# EAGLE design 2015 Receive LCD (EAGLE 6.5.0)
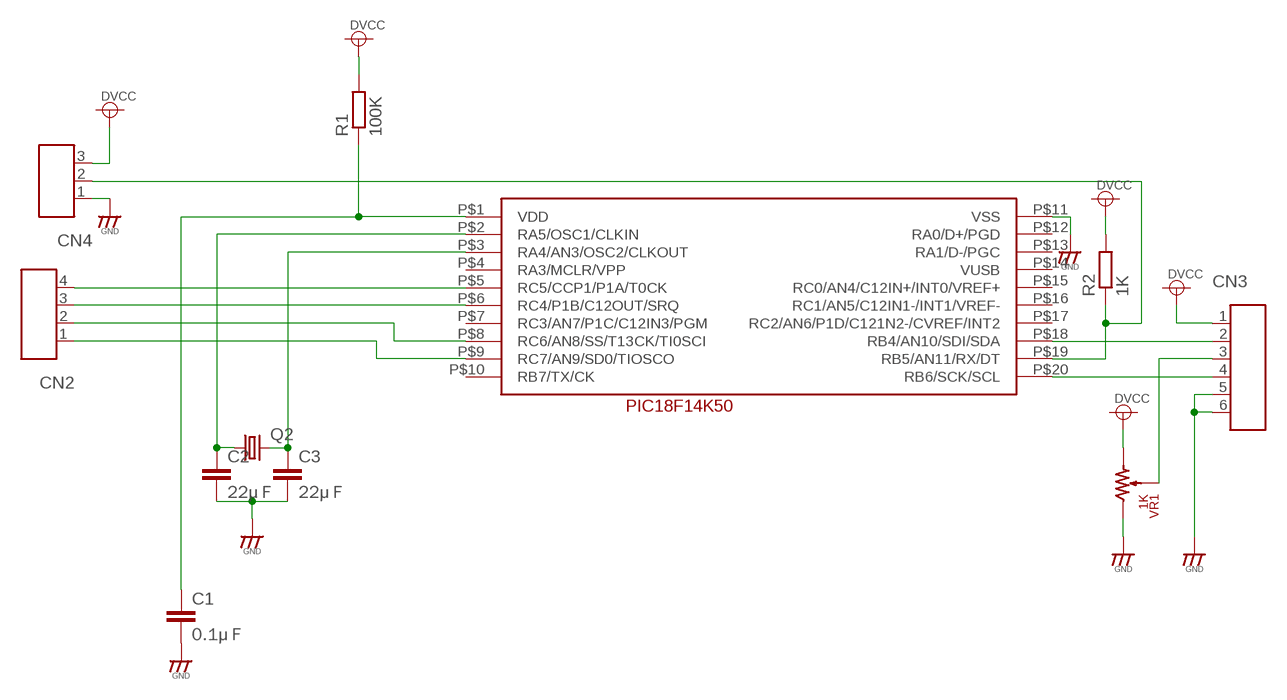
[diagram p0: schematic, sheet 1]

## Parts
C1  0.1μＦ  C-EU025-025X050  [C025-025X050]
C2  22μＦ  C-EU025-025X050  [C025-025X050]
C3  22μＦ  C-EU025-025X050  [C025-025X050]
CN2  CON_4P  [CON_HRS_DIP_4]
CN3  CON_6P  [CON_HRS_DIP_6]
CN4  CON_3P  [CON_HRS_DIP_3]
IC1  PIC18F14K50  [PIC18F14K50]
Q2  CRYTALHC49U70  [HC49U70]
R1  100K  R-EU_0204/7  [0204/7]
R2  1K  R-EU_0204/7  [0204/7]
VR1  1K  TRM  [TRM]

## Nets
DVCC: CN3.1 CN4.3 R1.2 R2.2 VR1.P$1
GND: C1.2 C2.2 C3.2 CN3.5 CN3.6 CN4.1 IC1.P$11(VSS) VR1.P$3
N$1: C1.1 IC1.P$1(VDD) R1.1
N$2: C3.1 IC1.P$3(RA4/AN3/OSC2/CLKOUT) Q2.2
N$3: C2.1 IC1.P$2(RA5/OSC1/CLKIN) Q2.1
N$4: CN2.1 IC1.P$9(RC7/AN9/SD0/TIOSCO)
N$5: CN3.2 IC1.P$18(RB4/AN10/SDI/SDA)
N$6: CN2.3 IC1.P$6(RC4/P1B/C12OUT/SRQ)
N$7: CN2.4 IC1.P$5(RC5/CCP1/P1A/T0CK)
N$8: CN2.2 IC1.P$8(RC6/AN8/SS/T13CK/TI0SCI)
N$9: CN3.4 IC1.P$20(RB6/SCK/SCL)
N$10: CN3.3 VR1.P$2
N$11: CN4.2 IC1.P$19(RB5/AN11/RX/DT) R2.1
Unconnected: IC1.P$7(RC3/AN7/P1C/C12IN3/PGM) IC1.P$10(RB7/TX/CK) IC1.P$12(RA0/D+/PGD) IC1.P$13(RA1/D-/PGC) IC1.P$14(VUSB) IC1.P$15(RC0/AN4/C12IN+/INT0/VREF+) IC1.P$16(RC1/AN5/C12IN1-/INT1/VREF-) IC1.P$17(RC2/AN6/P1D/C121N2-/CVREF/INT2)

## Power pins joined to a net without a drawn wire
RA3/MCLR/VPP: IC1.P$4(RA3/MCLR/VPP)

## Library data of the parts
C1-C3 = rcl:C-EU: CAPACITOR, European symbol
CN2 = da_parts:CON_4P
CN3 = da_parts:CON_6P
CN4 = da_parts:CON_3P
IC1 = pic18f14k50:PIC18F14K50
Q2 = crystal:CRYTAL: CRYSTAL
R1 R2 = rcl:R-EU_: RESISTOR, European symbol
VR1 = hardwarelib:TRM

## Net classes
0 default: clearance 0.205 mm

## Board
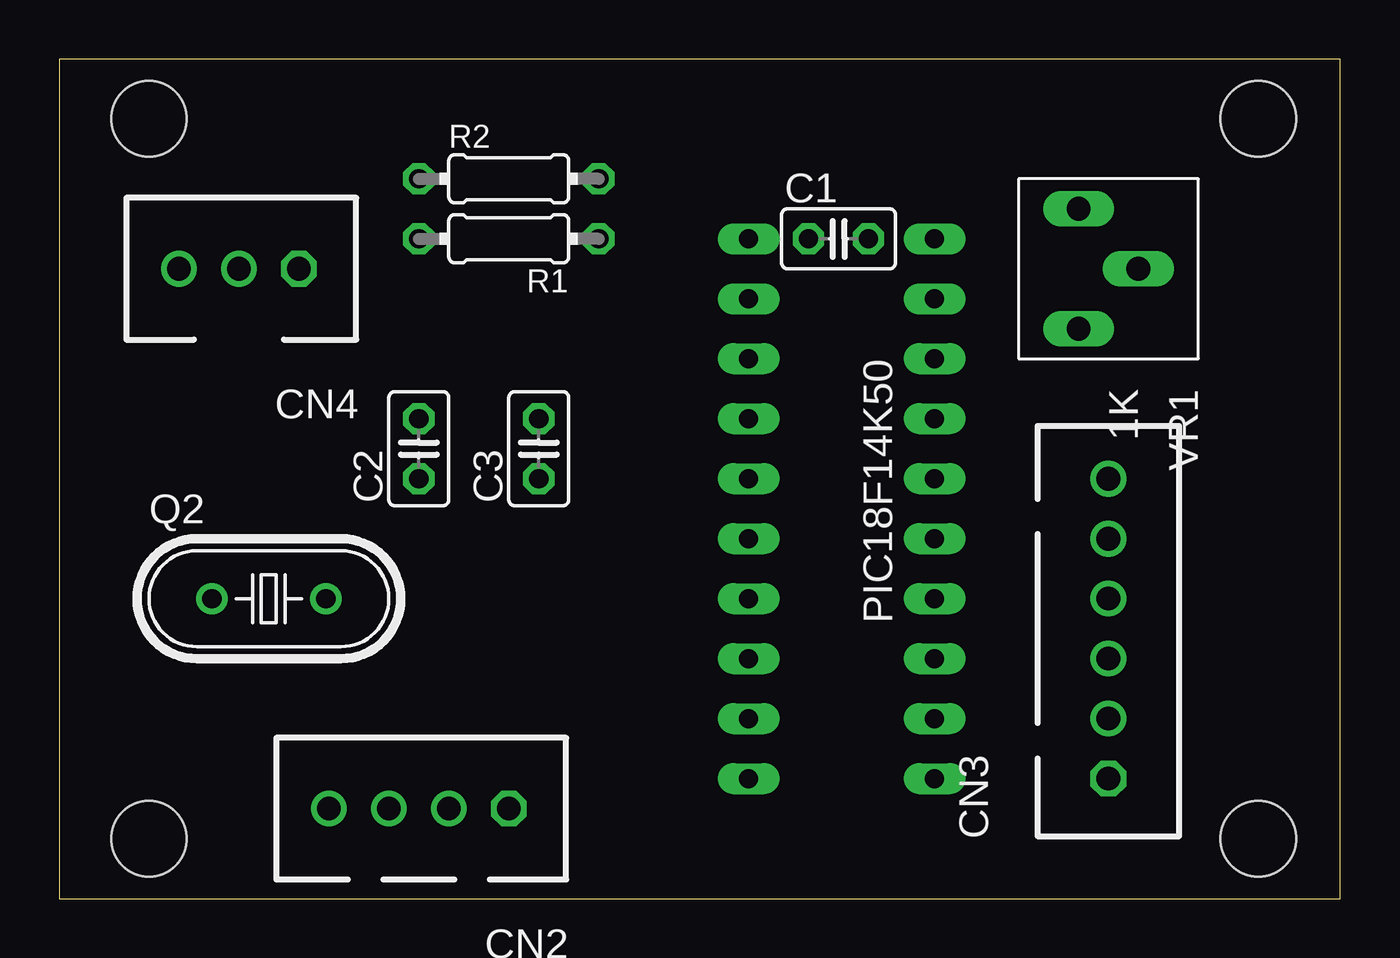
[diagram p1: board, top side]
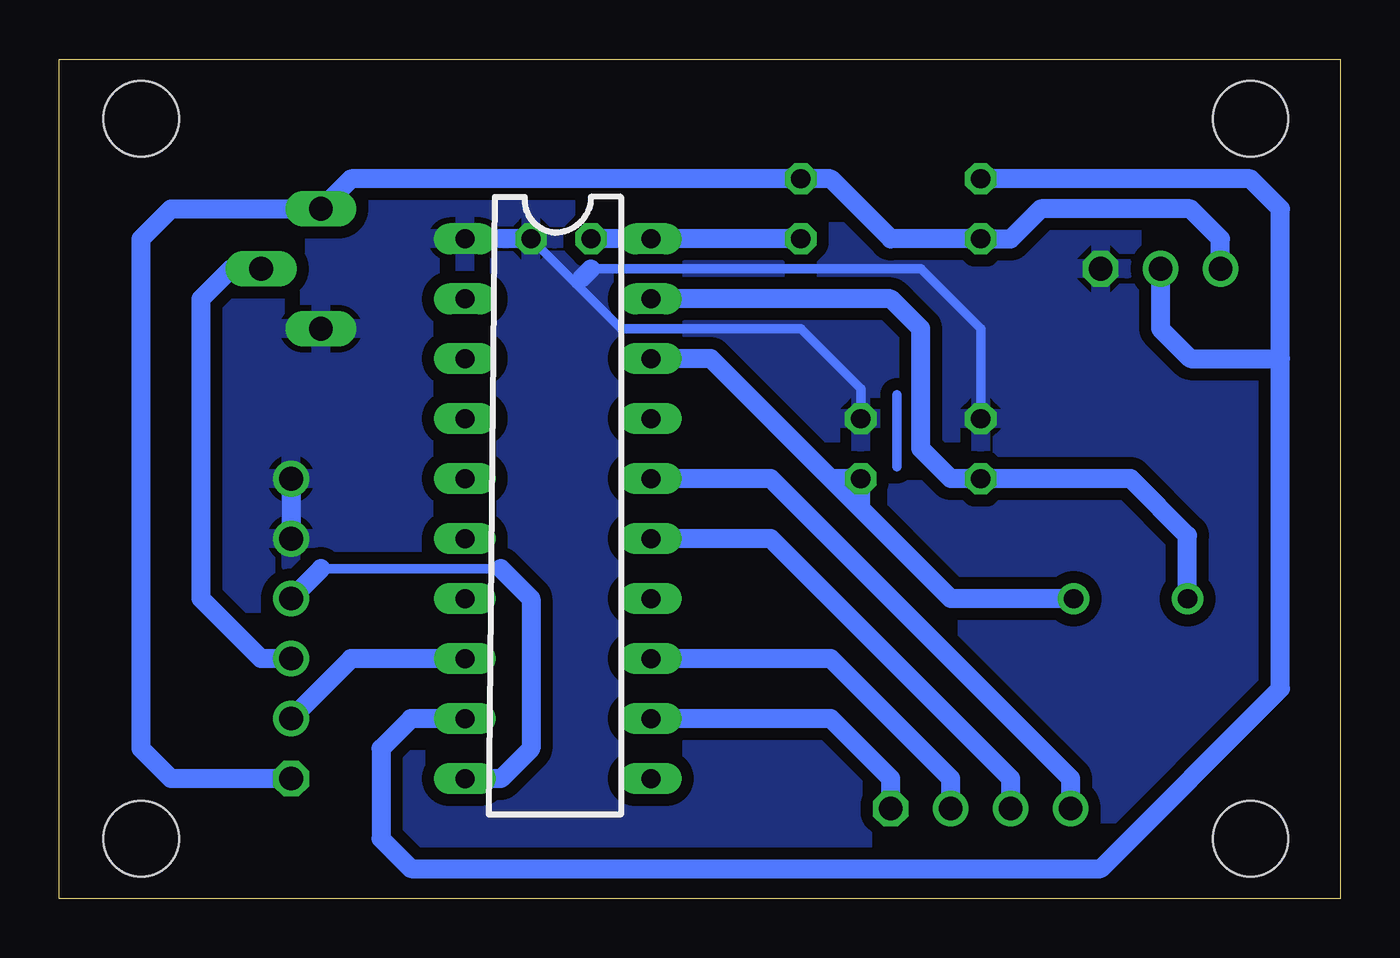
[diagram p2: board, bottom side, seen from below]

Size 54.28 x 35.55 mm. Coordinates in mm from the lower left corner, seen from the top.
Outline: 0,0 54.28,0 54.28,35.55 0,35.55 0,0
Copper layers (1*16): Top 0.035mm / dielectric 1.5mm / Bottom 0.035mm
Design rules "default *": minimum track width 10mil, minimum drill 24mil, track to track 20mil, track to pad 20mil, pad to pad 20mil, via to via 20mil, smd to smd 20mil, copper to edge 40mil, drill to drill 8mil, minimum pad ring 10mil, minimum via ring 8mil, stop-mask expansion 4mil, vias tented up to drill 0mil, thermal gap 10mil
Holes 3.2 mm at 3.81,2.54 3.81,33.02 50.8,33.02 50.8,2.54

### Footprints (pad centres in the part's own frame; a part is rotated, then mirrored left to right if it is on the bottom)
C025-025X050 = drill 0.813 octagon: 1 -1.27,0; 2 1.27,0
CON_HRS_DIP_4 = drill 1 octagon: 1 -3.81,0 | drill 1: 2 -1.27,0; 3 1.27,0; 4 3.81,0
CON_HRS_DIP_6 = drill 1 octagon: 1 -6.35,0 | drill 1: 2 -3.81,0; 3 -1.27,0; 4 1.27,0; 5 3.81,0; 6 6.35,0
CON_HRS_DIP_3 = drill 1 octagon: 1 -2.54,0 | drill 1: 2 0,0; 3 2.54,0
PIC18F14K50 = drill 0.8 long: P$1 -5.08,10.16; P$2 -5.08,7.62; P$3 -5.08,5.08; P$4 -5.08,2.54; P$5 -5.08,0; P$6 -5.08,-2.54; P$7 -5.08,-5.08; P$8 -5.08,-7.62; P$9 -5.08,-10.16; P$10 -5.08,-12.7; P$11 2.794,10.16; P$12 2.794,7.62; P$13 2.794,5.08; P$14 2.794,2.54; P$15 2.794,0; P$16 2.794,-2.54; P$17 2.794,-5.08; P$18 2.794,-7.62; P$19 2.794,-10.16; P$20 2.794,-12.7
HC49U70 = drill 0.813: 1 -2.413,0; 2 2.413,0
0204/7 = drill 0.813 octagon: 1 -3.81,0; 2 3.81,0
TRM = drill 1 long: P$1 0,0; P$2 2.54,2.54; P$3 5.08,0

### Placement (x,y rotation side)
C1  33.02,27.94 0 top
C2  15.24,19.05 90 top
C3  20.32,19.05 90 top
CN2  15.24,3.81 180 top
CN3  44.45,11.43 90 top
CN4  7.62,26.67 180 top
IC1  34.29,17.78 0 top
Q2  8.89,12.7 0 top
R1  19.05,27.94 180 top
R2  19.05,30.48 0 top
VR1  43.18,29.21 270 top

### Tracks (layer width: path | path; a pad name or v marks a point on that pad's centre or on a via)
DVCC
  Bottom 0.813: CN3.1 49.53,5.08 50.8,6.35 50.8,27.94 49.53,29.21 VR1.P$1 41.91,30.48 R2.2 21.59,30.48 19.05,27.94 R1.2 13.97,27.94 12.7,29.21 6.35,29.21 5.08,27.94 CN4.3
GND
  Bottom 0.406: C1.2 32.38,26.04 | 32.38,26.04 30.48,24.13 22.86,24.13 20.32,21.59 C3.2 | C2.2 15.24,24.13 17.78,26.67 31.75,26.67 | 32.13,26.29 32.38,26.04
  Bottom 0.813: CN3.6 CN3.5 | 36.83,27.94 IC1.P$11 C1.2 | 31.75,26.67 32.13,26.29
  pour Bottom: 0,35.56 0,0 54.61,0 54.61,35.56
N$1
  Bottom 0.813: C1.1 IC1.P$1 R1.1
N$2
  Bottom 0.813: Q2.2 16.51,12.7 20.32,16.51 | 20.32,16.51 C3.1 21.59,17.78 | 21.59,17.78 26.67,22.86 IC1.P$3 | 20.32,16.51 21.59,17.78
N$3
  Bottom 0.813: Q2.1 6.48,15.37 8.89,17.78 C2.1 16.51,17.78 17.78,19.05 17.78,24.13 19.05,25.4 IC1.P$2
N$4
  Bottom 0.813: IC1.P$9 21.59,7.62 19.05,5.08 CN2.1
N$5
  Bottom 0.813: IC1.P$18 41.91,10.16 CN3.2
N$6
  Bottom 0.813: IC1.P$6 24.13,15.24 13.97,5.08 CN2.3
N$7
  Bottom 0.813: CN2.4 11.43,5.08 24.13,17.78 IC1.P$5
N$8
  Bottom 0.813: IC1.P$8 21.59,10.16 16.51,5.08 CN2.2
N$9
  Bottom 0.406: 35.56,13.97 43.18,13.97
  Bottom 0.813: IC1.P$20 35.56,5.08 34.29,6.35 34.29,12.7 35.56,13.97 | 43.18,13.97 CN3.4
N$10
  Bottom 0.813: CN3.3 45.72,10.16 48.26,12.7 48.26,25.4 46.99,26.67 VR1.P$2
N$11
  Bottom 0.813: CN4.2 7.62,24.13 6.35,22.86 2.54,22.86 | 2.54,22.86 2.54,8.89 10.16,1.27 39.37,1.27 40.64,2.54 40.64,6.35 39.37,7.62 IC1.P$19 | 2.54,22.86 2.54,29.21 3.81,30.48 R2.1
N$12
  Bottom 0.406: 18.8,18.29 18.8,21.34